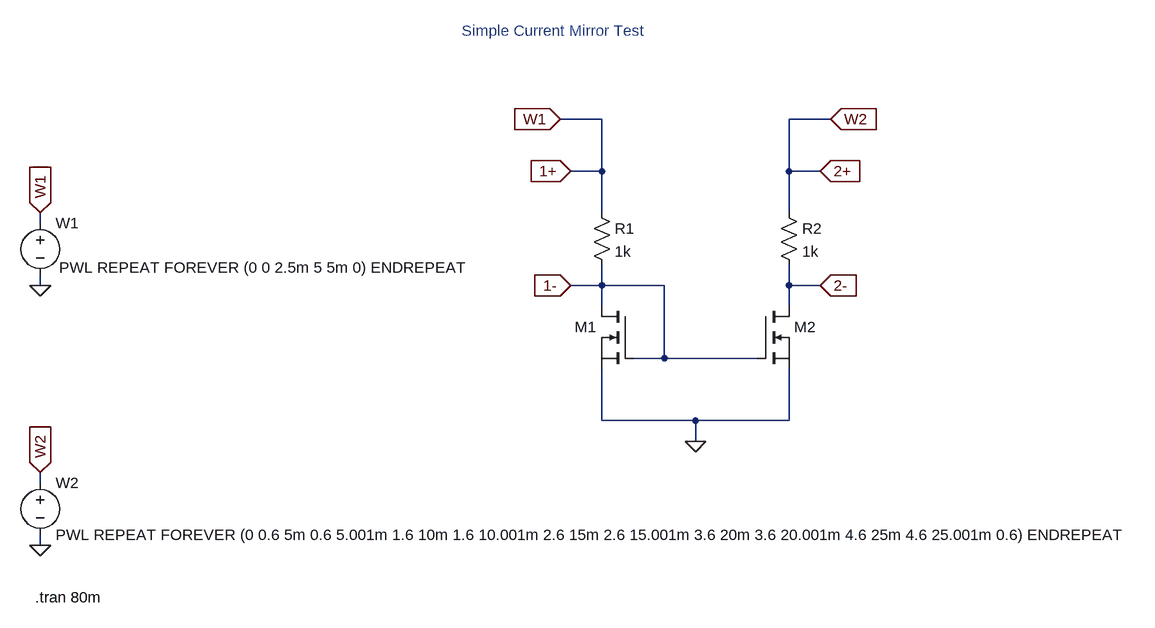
[diagram p0: schematic nmos_simple_current_mirror.asc]
nmos_simple_current_mirror.asc, the LTspice schematic file:
Version 4
SHEET 1 2016 1044
WIRE -208 -64 -272 -64
WIRE 144 -64 80 -64
WIRE -208 16 -208 -64
WIRE -208 16 -256 16
WIRE 80 16 80 -64
WIRE 128 16 80 16
WIRE -208 80 -208 16
WIRE 80 80 80 16
WIRE -1072 96 -1072 80
WIRE -1072 192 -1072 176
WIRE -208 192 -208 160
WIRE -208 192 -256 192
WIRE -112 192 -208 192
WIRE 80 192 80 160
WIRE 128 192 80 192
WIRE -208 224 -208 192
WIRE 80 224 80 192
WIRE -112 304 -112 192
WIRE -112 304 -160 304
WIRE 32 304 -112 304
WIRE -208 400 -208 320
WIRE -64 400 -208 400
WIRE 80 400 80 320
WIRE 80 400 -64 400
WIRE -64 432 -64 400
WIRE -1072 496 -1072 480
WIRE -1072 592 -1072 576
FLAG -1072 192 0
FLAG -1072 592 0
FLAG -1072 80 W1
IOPIN -1072 80 In
FLAG -1072 480 W2
IOPIN -1072 480 In
FLAG -64 432 0
FLAG -272 -64 W1
IOPIN -272 -64 In
FLAG 144 -64 W2
IOPIN 144 -64 In
FLAG -256 16 1+
IOPIN -256 16 In
FLAG -256 192 1-
IOPIN -256 192 In
FLAG 128 16 2+
IOPIN 128 16 In
FLAG 128 192 2-
IOPIN 128 192 In
SYMBOL voltage -1072 80 R0
WINDOW 3 29 84 Left 2
WINDOW 123 0 0 Left 0
WINDOW 39 0 0 Left 0
SYMATTR Value PWL REPEAT FOREVER (0 0 2.5m 5 5m 0) ENDREPEAT
SYMATTR InstName W1
SYMBOL voltage -1072 480 R0
WINDOW 123 0 0 Left 0
WINDOW 39 0 0 Left 0
SYMATTR InstName W2
SYMATTR Value PWL REPEAT FOREVER (0 0.6 5m 0.6 5.001m 1.6 10m 1.6 10.001m 2.6 15m 2.6 15.001m 3.6 20m 3.6 20.001m 4.6 25m 4.6 25.001m 0.6) ENDREPEAT
SYMBOL res -224 64 R0
SYMATTR InstName R1
SYMATTR Value 1k
SYMBOL res 64 64 R0
SYMATTR InstName R2
SYMATTR Value 1k
SYMBOL nmos -160 224 M0
WINDOW 3 56 72 Invisible 2
SYMATTR InstName M1
SYMATTR Value BSP89
SYMBOL nmos 32 224 R0
WINDOW 3 56 72 Invisible 2
SYMATTR InstName M2
SYMATTR Value BSP89
TEXT -424 -200 Left 2 ;Simple Current Mirror Test
TEXT -1080 672 Left 2 !.tran 80m

The netlist it stands for:
* nmos_simple_current_mirror.asc
V§W1 1+ 0 PWL REPEAT FOREVER (0 0 2.5m 5 5m 0) ENDREPEAT
V§W2 2+ 0 PWL REPEAT FOREVER (0 0.6 5m 0.6 5.001m 1.6 10m 1.6 10.001m 2.6 15m 2.6 15.001m 3.6 20m 3.6 20.001m 4.6 25m 4.6 25.001m 0.6) ENDREPEAT
R1 1+ 1- 1k
R2 2+ 2- 1k
M1 1- 1- 0 0 BSP89
M2 2- 1- 0 0 BSP89
.model NMOS NMOS
.model PMOS PMOS
.lib standard.mos
* Simple Current Mirror Test
.tran 80m
.backanno
.end